# Altium schematic sheet Sheet1.SchDoc
size 420 x 297 mm; Author: ALTIUM GOSTBOM2.0 KEV
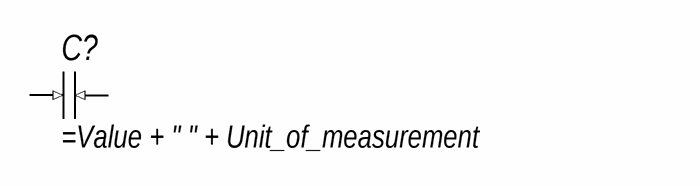
[diagram p0: Sheet1.SchDoc]

## Parts
C?  (no value)

## Nets

Not connected (* = marked no-connect by the designer): C? 1 2

## Notes on the sheet
- Перв. примен.
- Справ. №
- Подп. дата
- Инв. № дубл.
- Взам. инв. №
- Подп. и дата
- Изм.
- Разраб.
- Лист
- № докум.
- Подп.
- Дата
- Лит.
- Масса
- Масштаб
- Пров.
- Т.контр.
- Листов
- Инв. № подл.
- Н.контр.
- Утв.
- ALTIUM GOSTBOM2.0 KEV
- Файл:
- Копировал
- Формат А3

## Library data of the parts
C? = CAP_0603: Конденсатор керамический, типоразмера 0603; Unit_of_measurement: Ф; Value: *; ComponentLink1Description: New link; ComponentLink1URL: *